# EAGLE design Arduino Ibus (EAGLE 6.5.0)
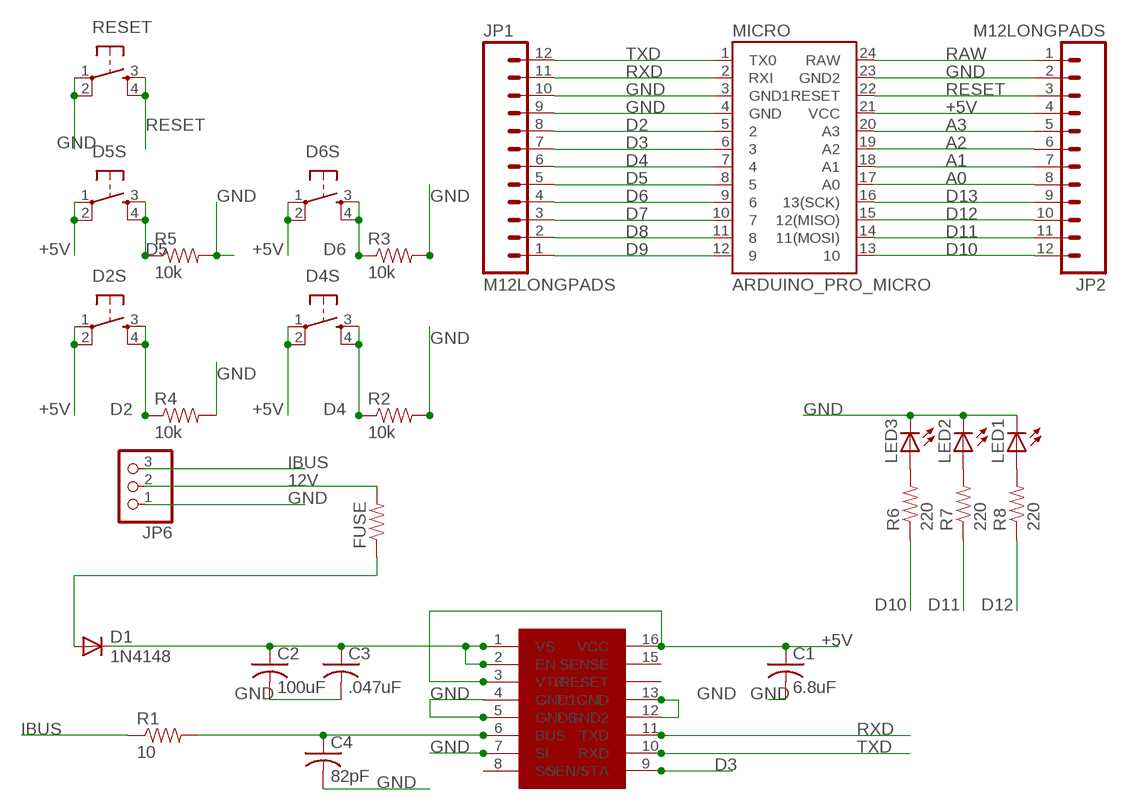
[diagram p0: schematic, sheet 1]

## Parts
C1  6.8uF  C-USC1206  [C1206]
C2  100uF  C-USC1206  [C1206]
C3  .047uF  C-USC1206  [C1206]
C4  82pF  C-USC1206  [C1206]
D1  1N4148  DIODESMA  [SMA-DIODE]
D2S  TAC_SWITCHPTH  [TACTILE-PTH]
D4S  TAC_SWITCHPTH  [TACTILE-PTH]
D5S  TAC_SWITCHPTH  [TACTILE-PTH]
D6S  TAC_SWITCHPTH  [TACTILE-PTH]
FUSE  RESISTOR1206  [1206]
JP1  M12LONGPADS  [1X12_LONGPADS]
JP2  M12LONGPADS  [1X12_LONGPADS]
JP6  PINHD-1X3  [1X03]
LED1  LED1206  [LED-1206]
LED2  LED1206  [LED-1206]
LED3  LED1206  [LED-1206]
MICRO  ARDUINO_PRO_MICRO  [ARDUINO_PRO_MICRO]
R1  10  RESISTOR1206  [1206]
R2  10k  RESISTOR1206  [1206]
R3  10k  RESISTOR1206  [1206]
R4  10k  RESISTOR1206  [1206]
R5  10k  RESISTOR1206  [1206]
R6  220  RESISTOR1206  [1206]
R7  220  RESISTOR1206  [1206]
R8  220  RESISTOR1206  [1206]
RESET  TAC_SWITCHPTH  [TACTILE-PTH]
U$1  TH3122  [SO16W]

## Nets
12V [POWER]: FUSE.2 JP6.2
+5V [POWER]: C1.1 D2S.1 D2S.2 D4S.1 D4S.2 D5S.1 D5S.2 D6S.1 D6S.2 JP2.4 MICRO.21(VCC) U$1.3(VTR) U$1.16(VCC)
+12V [POWER]: D1.A FUSE.1
A0: JP2.8 MICRO.17(A0)
A1: JP2.7 MICRO.18(A1)
A2: JP2.6 MICRO.19(A2)
A3: JP2.5 MICRO.20(A3)
D2: D2S.3 D2S.4 JP1.8 MICRO.5 R4.1
D3: JP1.7 MICRO.6 U$1.9(SEN/STA)
D4: D4S.3 D4S.4 JP1.6 MICRO.7 R2.1
D5: D5S.3 D5S.4 JP1.5 MICRO.8 R5.1
D6: D6S.3 D6S.4 JP1.4 MICRO.9 R3.1
D7: JP1.3 MICRO.10
D8: JP1.2 MICRO.11
D9: JP1.1 MICRO.12
D10: JP2.12 MICRO.13 R6.1
D11: JP2.11 MICRO.14(11(MOSI)) R7.1
D12: JP2.10 MICRO.15(12(MISO)) R8.1
D13: JP2.9 MICRO.16(13(SCK))
GND [GND]: C1.2 C2.2 C3.2 C4.2 JP1.9 JP1.10 JP2.2 JP6.1 LED1.C LED2.C LED3.C MICRO.3(GND1) MICRO.4(GND) MICRO.23(GND2) R2.2 R3.2 R4.2 R5.2 RESET.1 RESET.2 U$1.4(GND1) U$1.5(GND3) U$1.7(SI) U$1.12(GND2) U$1.13(GND)
IBUS: JP6.3 R1.1
N$1: LED1.A R8.2
N$2: LED2.A R7.2
N$3: C2.1 C3.1 D1.C U$1.1(VS) U$1.2(EN)
N$4: C4.1 R1.2 U$1.6(BUS)
N$5: LED3.A R6.2
RAW: JP2.1 MICRO.24(RAW)
RESET: JP2.3 MICRO.22(RESET) RESET.3 RESET.4
RXD: JP1.11 MICRO.2(RXI) U$1.11(TXD)
TXD: JP1.12 MICRO.1(TX0) U$1.10(RXD)
Unconnected: U$1.8(SO) U$1.14(RESET) U$1.15(SENSE)

## Library data of the parts
C1-C4 = resistor:C-US: CAPACITOR, American symbol
D1 = SparkFun-DiscreteSemi:DIODE: Diode These are standard reverse protection diodes and small signal diodes. SMA package can handle up to about 1A. SOD-323 can handle about 200mA. What the SOD-323 package when ordering, there are some mfgs out there that are 5-pin packages.
D2S D4S D5S D6S RESET = SparkFun-Electromechanical:TAC_SWITCH: Momentary Switch Button commonly used for reset or general input. Spark Fun Electronics SKU : COM-00097 SMT- SWCH-08247
FUSE R1-R8 = SparkFun-Passives:RESISTOR: Resistor Basic schematic elements and footprints for 0603, 1206, and PTH resistors.
JP1 JP2 = SparkFun-Connectors:M12: Header 12 Standard 12-pin 0.1" header. Use with straight break away headers (SKU : PRT-00116), right angle break away headers (PRT-00553), swiss pins (PRT-00743), machine pins (PRT-00117), and female headers (PRT-00115).
JP6 = pinhead:PINHD-1X3: PIN HEADER
LED1-LED3 = SparkFun-LED:LED: LEDs Standard schematic elements and footprints for 5mm, 3mm, 1206, and 0603 sized LEDs. 5mm - Spark Fun Electronics SKU : COM-00529 (and others)
MICRO = SparkFun-Boards:ARDUINO_PRO_MICRO
U$1 = Melexisth3122:TH3122

## Net classes
0 default: width 0.254 mm, drill 0.254 mm, clearance 0.381 mm
1 GND: width 0.254 mm, drill 0.254 mm, clearance 0.254 mm
2 POWER: width 0.254 mm, drill 0.254 mm, clearance 0.254 mm

## Board
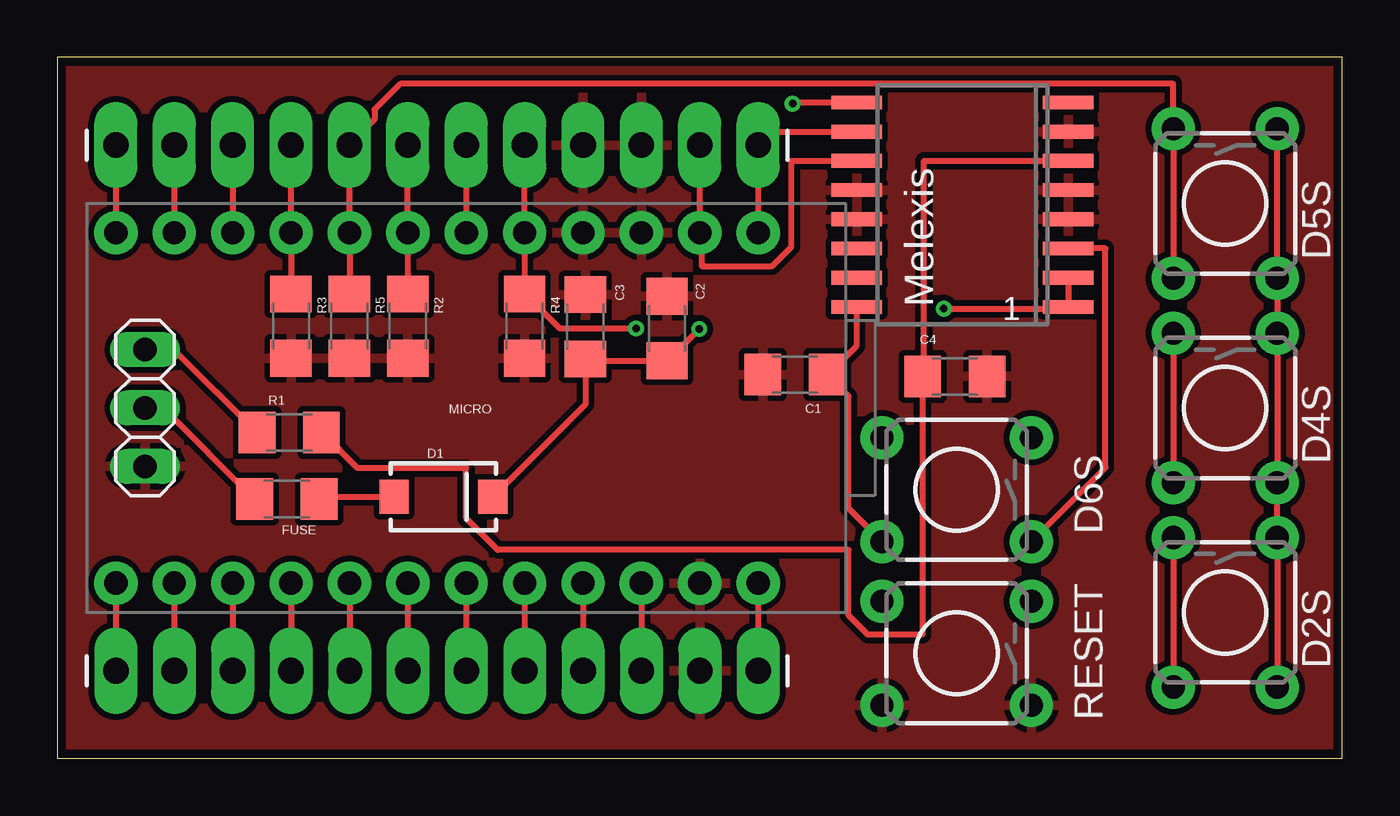
[diagram p1: board, top side]
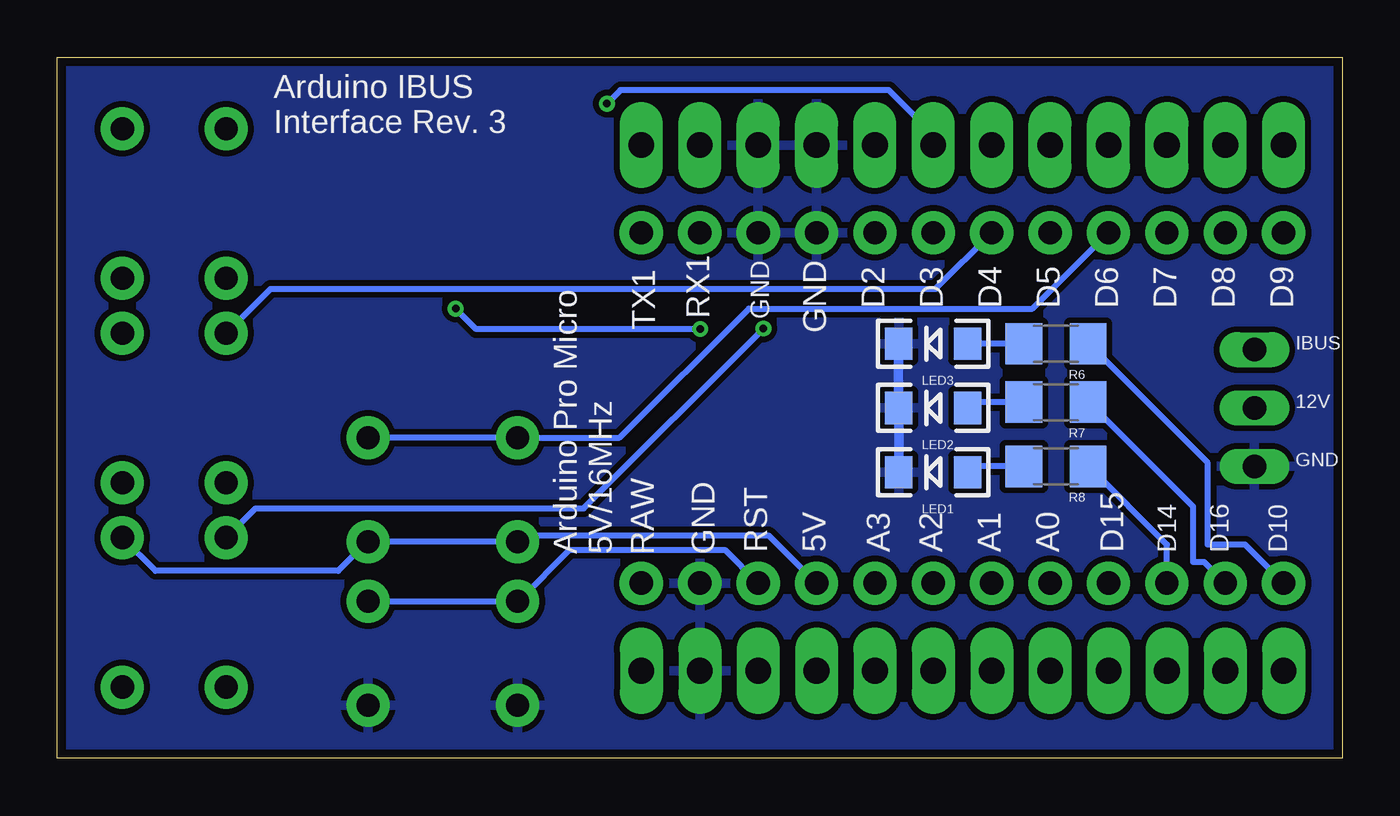
[diagram p2: board, bottom side, seen from below]

Size 55.88 x 30.48 mm. Coordinates in mm from the lower left corner, seen from the top.
Outline: 0,0 55.88,0 55.88,30.48 0,30.48 0,0
Copper layers (1*16): Top 0.0356mm / dielectric 1.5011mm / Bottom 0.0356mm
Design rules "LaenPCBOrder": minimum track width 6mil, minimum drill 13mil, track to track 6mil, track to pad 6mil, pad to pad 6mil, via to via 6mil, smd to smd 6mil, copper to edge 15mil, drill to drill 6mil, minimum pad ring 7mil, minimum via ring 7mil, stop-mask expansion 4mil, vias tented up to drill 0mil, thermal gap 10mil

### Footprints (pad centres in the part's own frame; a part is rotated, then mirrored left to right if it is on the bottom)
C1206 = smd 1.6 x 1.8: 1 -1.4,0; 2 1.4,0
SMA-DIODE = smd 1.27 x 1.47: A -2.15,0; C 2.15,0
TACTILE-PTH = drill 1.016 pad 1.88: 1 -3.251,2.261; 2 3.251,2.261; 3 -3.251,-2.261; 4 3.251,-2.261
1206 = smd 1.6 x 1.8: 1 -1.4,0; 2 1.4,0
1X12_LONGPADS = drill 1.118 pad 1.88 long: 1 0,0; 2 2.54,0; 3 5.08,0; 4 7.62,0; 5 10.16,0; 6 12.7,0; 7 15.24,0; 8 17.78,0; 9 20.32,0; 10 22.86,0; 11 25.4,0; 12 27.94,0
1X03 = drill 1.016 long: 1 -2.54,0; 2 0,0; 3 2.54,0
LED-1206 = smd 1.2 x 1.4: A -1.5,0; C 1.5,0
ARDUINO_PRO_MICRO = drill 1.016 pad 1.88: 1 -7.62,12.7; 2 -7.62,10.16; 3 -7.62,7.62; 4 -7.62,5.08; 5 -7.62,2.54; 6 -7.62,0; 7 -7.62,-2.54; 8 -7.62,-5.08; 9 -7.62,-7.62; 10 -7.62,-10.16; 11 -7.62,-12.7; 12 -7.62,-15.24; 13 7.62,-15.24; 14 7.62,-12.7; 15 7.62,-10.16; 16 7.62,-7.62; 17 7.62,-5.08; 18 7.62,-2.54; 19 7.62,0; 20 7.62,2.54; 21 7.62,5.08; 22 7.62,7.62; 23 7.62,10.16; 24 7.62,12.7
SO16W = smd 0.6 x 2.2: 1 -4.445,-4.6; 2 -3.175,-4.6; 3 -1.905,-4.6; 4 -0.635,-4.6; 5 0.635,-4.6; 6 1.905,-4.6; 7 3.175,-4.6; 8 4.445,-4.6; 9 4.445,4.6; 10 3.175,4.6; 11 1.905,4.6; 12 0.635,4.6; 13 -0.635,4.6; 14 -1.905,4.6; 15 -3.175,4.6; 16 -4.445,4.6

### Placement (x,y rotation side)
C1  32.08,16.69 180 top
C2  26.52,18.69 90 top
C3  22.96,18.77 90 top
C4  39.04,16.61 0 top
D1  16.79,11.38 0 top
D2S  50.8,6.35 270 top
D4S  50.8,15.24 270 top
D5S  50.8,24.13 270 top
D6S  39.12,11.68 180 top
FUSE  9.98,11.28 180 top
JP1  2.54,26.67 0 top
JP2  30.48,3.81 180 top
JP6  3.81,15.24 90 top
LED1  17.78,12.45 180 bottom
LED2  17.78,15.24 180 bottom
LED3  17.78,18.03 180 bottom
MICRO  17.78,15.24 270 top
R1  10.08,14.17 0 top
R2  15.24,18.8 270 top
R3  10.16,18.8 270 top
R4  20.32,18.8 270 top
R5  12.7,18.8 270 top
R6  12.45,18.03 180 bottom
R7  12.45,15.49 180 bottom
R8  12.45,12.7 180 bottom
RESET  39.12,4.57 180 top
U$1  39.37,24.08 90 top

### Tracks (layer width: path | path; a pad name or v marks a point on that pad's centre or on a via)
12V
  Top 0.254: JP6.2 4.6,15.24 8.56,11.28 FUSE.2
+5V
  Top 0.254: MICRO.21 JP2.4 | D2S.2 D2S.1 D4S.2 D4S.1 D5S.2 D5S.1 | U$1.3 45.59,22.17 45.59,12.65 D6S.1 | U$1.16 34.75,19.63 34.75,17.93 33.5,16.69 C1.1 33.58,16.59 34.42,15.75 34.42,10.87 D6S.2
  Bottom 0.254: MICRO.21 24.94,9.7 35.59,9.7 D6S.2 D6S.1 42.47,9.35 43.66,8.15 51.61,8.15 D2S.1
+12V
  Top 0.254: D1.A 11.4,11.38 11.4,11.28 FUSE.1
A0
  Top 0.254: MICRO.17 JP2.8
A1
  Top 0.254: MICRO.18 JP2.7
A2
  Top 0.254: MICRO.19 JP2.6
A3
  Top 0.254: MICRO.20 JP2.5
D2  (via drill 0.33)
  Top 0.254: JP1.8 MICRO.5 R4.1 20.42,20.14 21.87,18.69 v25.17,18.69 | D2S.3 D2S.4
  Bottom 0.254: v25.17,18.69 32.99,10.87 47.27,10.87 D2S.3
D3  (via drill 0.33)
  Top 0.254: JP1.7 MICRO.6 | U$1.9 31.98,28.52 v31.98,28.47
  Bottom 0.254: v31.98,28.47 31.39,29.06 19.71,29.06 17.78,27.13 JP1.7
D4
  Top 0.254: R2.1 MICRO.7 JP1.6 | D4S.3 D4S.4
  Bottom 0.254: MICRO.7 17.68,20.42 46.61,20.42 D4S.3
D5
  Top 0.254: R5.1 MICRO.8 JP1.5 12.78,26.77 13.79,27.79 13.79,28.22 14.91,29.34 48.54,29.34 D5S.3 D5S.4
D6
  Top 0.254: JP1.4 MICRO.9 R3.1
  Bottom 0.254: MICRO.9 13.46,19.56 25.81,19.56 31.42,13.95 D6S.4 D6S.3
D7
  Top 0.254: JP1.3 MICRO.10
D8
  Top 0.254: JP1.2 MICRO.11
D9
  Top 0.254: JP1.1 MICRO.12
D10
  Top 0.254: MICRO.13 JP2.12
  Bottom 0.254: MICRO.13 4.22,9.3 5.84,9.3 5.84,12.85 11.02,18.03 R6.1
D11
  Top 0.254: MICRO.14 JP2.11
  Bottom 0.254: MICRO.14 5.99,8.53 6.48,8.53 6.48,10.95 11.02,15.49 R7.1
D12
  Top 0.254: MICRO.15 JP2.10
  Bottom 0.254: MICRO.15 7.62,9.3 11.02,12.7 R8.1
D13
  Top 0.254: MICRO.16 JP2.9
GND
  Bottom 0.406: LED1.C LED2.C 19.3,15.24 19.3,17.27
  pour Bottom: 0,0 0,30.48 55.88,30.48 55.88,0
  pour Top: 0,0 0,30.48 55.88,30.48 55.88,0
IBUS
  Top 0.254: JP6.3 5.05,17.78 8.66,14.17 R1.1
N$1
  Bottom 0.254: R8.2 16,12.7 16.26,12.45 LED1.A
N$2
  Bottom 0.254: R7.2 16,15.49 16.26,15.24 LED2.A
N$3  (via drill 0.33)
  Top 0.254: U$1.2 U$1.1 43.87,19.56 v38.56,19.56 | D1.C 22.96,15.39 C3.1 23.06,17.3 C2.1 26.62,17.37 v27.91,18.67
  Bottom 0.254: v38.56,19.56 37.67,18.67 v27.91,18.67
N$4
  Top 0.254: R1.2 11.51,14.17 13.06,12.62 17.78,12.62 17.78,10.44 19.15,9.07 34.42,9.07 34.42,6.22 35.26,5.38 37.62,5.38 37.62,16.61 C4.1 37.69,16.71 37.69,25.98 U$1.6
N$5
  Bottom 0.254: R6.2 LED3.A
RAW
  Top 0.254: MICRO.24 JP2.1
RESET
  Top 0.254: MICRO.22 JP2.3
  Bottom 0.254: RESET.3 RESET.4 35.76,6.91 33.6,9.07 26.85,9.07 MICRO.22
RXD
  Top 0.254: JP1.11 MICRO.2 28.02,22.76 28.02,21.41 31.09,21.41 31.93,22.25 31.93,25.98 U$1.11
TXD
  Top 0.254: MICRO.1 JP1.12 30.56,26.77 30.56,27.25 U$1.10

### Text on the board
tNames: 1
bNames: Arduino IBUS / Interface Rev. 3 | GND | GND | RX1 | D9 | D8 | D7 | D6 | D5 | D4 | D3 | D2 | TX1 | IBUS | 12V | GND | GND | RAW | D10 | D16 | D14 | D15 | A0 | A1 | A2 | A3 | 5V | RST | Arduino Pro Micro / 5V/16MHz